# Altium schematic sheet stepper.SchDoc
size A4
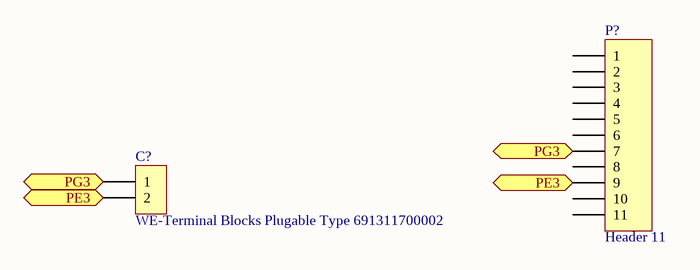
[diagram p0: stepper.SchDoc]

## Parts
C?  WE-Terminal Blocks Plugable Type 691311700002  [691311700002]
P?  Header 11  [HDR1X11]

## Ports
PE3 (in), PE3 (out), PG3 (in), PG3 (out)

## Nets
PE3: C?.2 P?.9 ; port PE3
PG3: C?.1 P?.7 ; port PG3

Not connected (* = marked no-connect by the designer): P? 1 2 3 4 5 6 8 10 11

## Library data of the parts
C? = WE-Terminal Blocks Plugable Type 691311700002: WR-TBL Terminal block - serie 3117 - 5.00mm; Manufacturer: W¨¹rth Elektronik eiSos GmbH; ComponentLink1 Description: Manufacturer; ComponentLink2 Description: Datasheet; NoPins: 02; Created Date: 6 January 2014; partNo: 691311700002; ComponentLink1URL: http://www.we-online.com; ComponentLink2URL: http://katalog.we-online.de/em/datasheet/6913117000xx.pdf; Created by: Karrer Zheng
P? = Header 11: Header, 11-Pin; LatestRevisionDate: 17-Jul-2002; LatestRevisionNote: Re-released for DXP Platform.; Publisher: Altium Limited